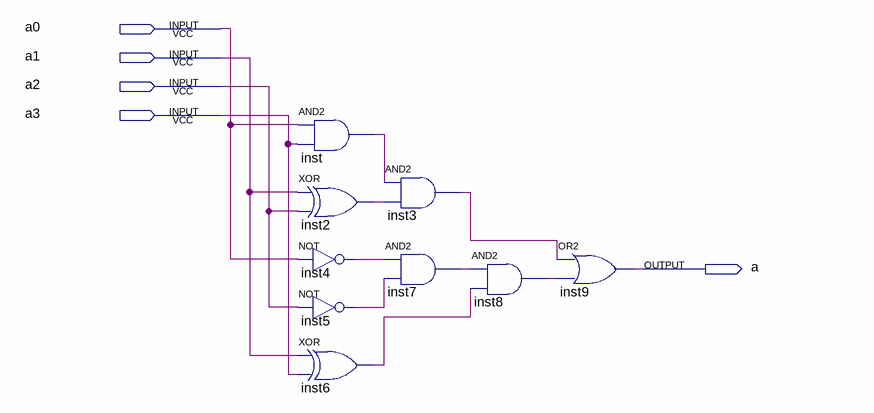
[diagram p0: schematic sheet]
// Quartus schematic a_segment.bdf as structural Verilog: 9 symbols, 5 pins
module a_segment (
  input  a0,
  input  a1,
  input  a2,
  input  a3,
  output a
);

  wire inst2_out, inst3_out, inst4_out, inst5_out, inst6_out, inst7_out, inst8_out, inst_out;

  and inst (inst_out, a0, a3);
  xor inst2 (inst2_out, a1, a2);
  not inst4 (inst4_out, a0);
  not inst5 (inst5_out, a2);
  xor inst6 (inst6_out, a1, a3);
  and inst3 (inst3_out, inst_out, inst2_out);
  and inst7 (inst7_out, inst4_out, inst5_out);
  and inst8 (inst8_out, inst7_out, inst6_out);
  or inst9 (a, inst3_out, inst8_out);
endmodule
